# Altium schematic sheet 012_2N3906.SchDoc
size A4; SheetNumber: 1; SheetTotal: 1
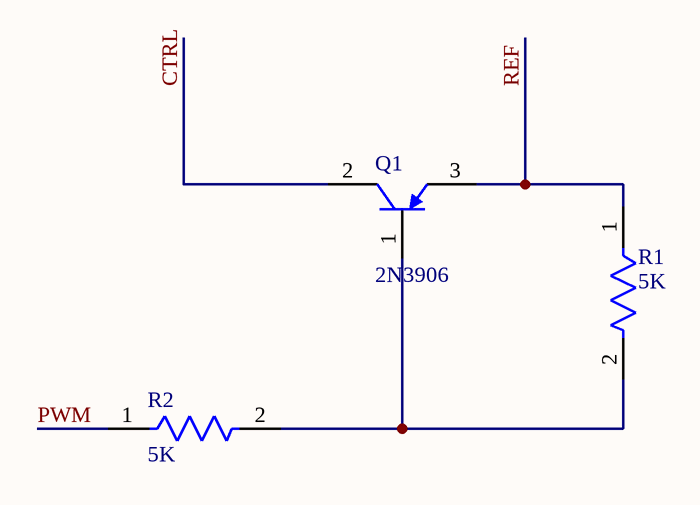
[diagram p0: 012_2N3906.SchDoc]

## Parts
Q1  2N3906  [ONSC-SOT-89_PCP-1-3-419AU_V]
R1  5K  [FP-CRCW1206-e3-IPC_C]
R2  5K  [FP-CRCW1206-e3-IPC_C]

## Nets
CTRL: Q1.2(C)
PWM: R2.1
REF: Q1.3(E) R1.1
NetQ1_1: Q1.1(B) R1.2 R2.2

## Library data of the parts
Q1 = CMP-1048-00974-1: Bipolar Transistor, -50 V, -2 A, Low VCE(sat), PNP Single, 3-Pin SOT-89, Pb-Free, Tape and Reel; Manufacturer: On Semiconductor; PartNumber: 2SB1123S-TD-E; ComponentLink2URL: http://www.onsemi.com/pub_link/Collateral/EN1727-D.PDF; PackageDescription: 3-Pin Small Outline Transistor, Body 4.5 x 2.5 mm, Pitch 1.5 mm; PackageReference: SOT-89_PCP-1-3-419AU; RoHS: TRUE; IC Continuous (A): -2; Mounting Technology: Surface Mount; ComponentLink1URL: http://www.onsemi.com/; PackageVersion: Rev. O, 04/2012; ComponentLink2Description: Datasheet; ComponentLink3URL: http://www.onsemi.com/pub_link/Collateral/ENA1087-D.PDF; Packing: Tape and Reel; ComponentLink1Description: Manufacturer URL; ComponentLink3Description: Package Specification; Polarity: PNP
R1 R2 = CMP-2003-02034-2: RES Thick Film, 1kΩ, 1%, 0.25W, 100ppm/°C, 1206; Voltage Rating: 200V; Max Power Dissipation: 250mW; Resistance: 2.2kR; Voltage Rating (DC): 200V; Depth: 1.6mm; Max Operating Temperature: 155°C; Width: 1.6mm; Packaging: Tape and Reel; Min Operating Temperature: -55°C; Military Standard: Not; Weight: 0.000353oz; Package Quantity: 10; Case Code (Metric): 3216; Length: 3.2mm; Lead Free: Lead Free; Case/Package: 1206; Number of Terminations: 2; Temperature Coefficient: 100ppm/°C; Case Code (Imperial): 1206; Power Rating: 250mW; Contact Plating: Tin; Composition: Thick Film; Features: Automotive AEC-Q200; Termination: SMD/SMT; Height: 0.55mm; Tolerance: 1%; Radiation Hardening: No